# Altium project Obscurum.PrjPcb
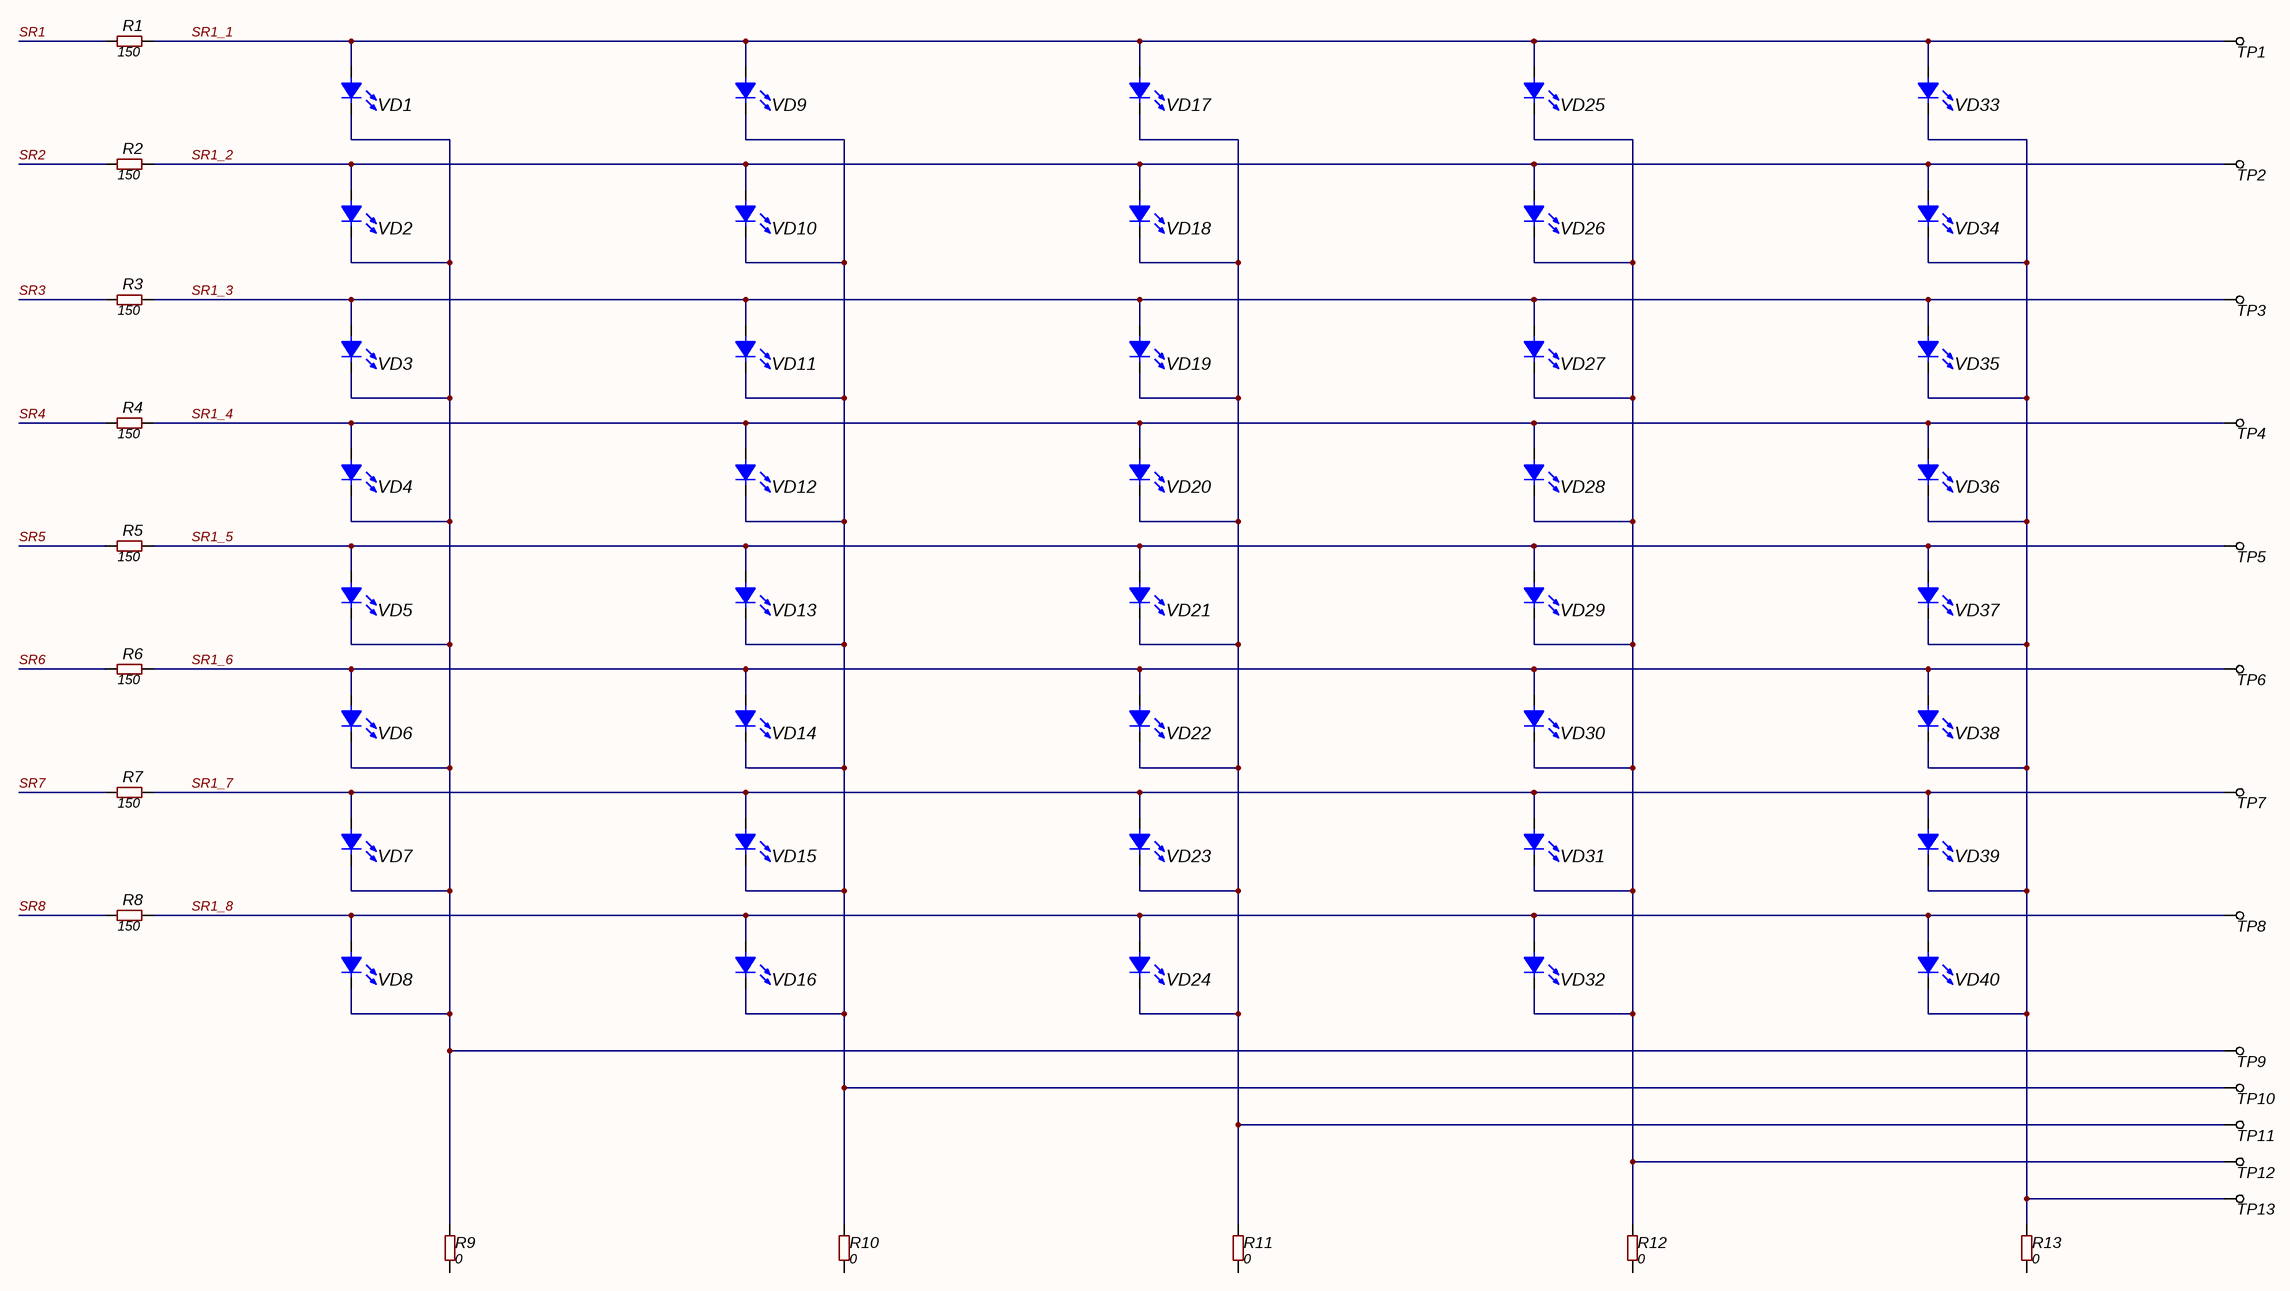
[diagram p0: 1206_array.SchDoc]
3 sheets, 139 parts. Net scope: global (net labels, ports and power ports of the same name join across sheets).
Board file: PCB1.PcbDoc
Sheets:
  1206_array.SchDoc
  0805_array.SchDoc
  Board.SchDoc

## Sheet 1206_array.SchDoc
size 594 x 420 mm; Address1: Address1; Address2: Address2; Address3: Address3; Address4: Address4; DocumentNumber: АБВГ.123456.001 Э3; SheetNumber: 1; SheetTotal: 3; Scale: 1:1; DocumentType: Схема электрическая принципиальная; FirstReferrence: АБВГ.123456.001

### Parts
R1  value 150  [RES: 0603]
R2  value 150  [RES: 0603]
R3  value 150  [RES: 0603]
R4  value 150  [RES: 0603]
R5  value 150  [RES: 0603]
R6  value 150  [RES: 0603]
R7  value 150  [RES: 0603]
R8  value 150  [RES: 0603]
R9  value 0  [RES: 0603]
R10  value 0  [RES: 0603]
R11  value 0  [RES: 0603]
R12  value 0  [RES: 0603]
R13  value 0  [RES: 0603]
TP1  Testpoint_HS1mm  [TestPoint(without 3D)]  (value not drawn)
TP2  Testpoint_HS1mm  [TestPoint(without 3D)]  (value not drawn)
TP3  Testpoint_HS1mm  [TestPoint(without 3D)]  (value not drawn)
TP4  Testpoint_HS1mm  [TestPoint(without 3D)]  (value not drawn)
TP5  Testpoint_HS1mm  [TestPoint(without 3D)]  (value not drawn)
TP6  Testpoint_HS1mm  [TestPoint(without 3D)]  (value not drawn)
TP7  Testpoint_HS1mm  [TestPoint(without 3D)]  (value not drawn)
TP8  Testpoint_HS1mm  [TestPoint(without 3D)]  (value not drawn)
TP9  Testpoint_HS1mm  [TestPoint(without 3D)]  (value not drawn)
TP10  Testpoint_HS1mm  [TestPoint(without 3D)]  (value not drawn)
TP11  Testpoint_HS1mm  [TestPoint(without 3D)]  (value not drawn)
TP12  Testpoint_HS1mm  [TestPoint(without 3D)]  (value not drawn)
TP13  Testpoint_HS1mm  [TestPoint(without 3D)]  (value not drawn)
VD1  (no value)  [LED: 1206Y]
VD2  (no value)  [LED: 1206Y]
VD3  (no value)  [LED: 1206Y]
VD4  (no value)  [LED: 1206Y]
VD5  (no value)  [LED: 1206Y]
VD6  (no value)  [LED: 1206Y]
VD7  (no value)  [LED: 1206Y]
VD8  (no value)  [LED: 1206Y]
VD9  (no value)  [LED: 1206Y]
VD10  (no value)  [LED: 1206Y]
VD11  (no value)  [LED: 1206Y]
VD12  (no value)  [LED: 1206Y]
VD13  (no value)  [LED: 1206Y]
VD14  (no value)  [LED: 1206Y]
VD15  (no value)  [LED: 1206Y]
VD16  (no value)  [LED: 1206Y]
VD17  (no value)  [LED: 1206Y]
VD18  (no value)  [LED: 1206Y]
VD19  (no value)  [LED: 1206Y]
VD20  (no value)  [LED: 1206Y]
VD21  (no value)  [LED: 1206Y]
VD22  (no value)  [LED: 1206Y]
VD23  (no value)  [LED: 1206Y]
VD24  (no value)  [LED: 1206Y]
VD25  (no value)  [LED: 1206Y]
VD26  (no value)  [LED: 1206Y]
VD27  (no value)  [LED: 1206Y]
VD28  (no value)  [LED: 1206Y]
VD29  (no value)  [LED: 1206Y]
VD30  (no value)  [LED: 1206Y]
VD31  (no value)  [LED: 1206Y]
VD32  (no value)  [LED: 1206Y]
VD33  (no value)  [LED: 1206Y]
VD34  (no value)  [LED: 1206Y]
VD35  (no value)  [LED: 1206Y]
VD36  (no value)  [LED: 1206Y]
VD37  (no value)  [LED: 1206Y]
VD38  (no value)  [LED: 1206Y]
VD39  (no value)  [LED: 1206Y]
VD40  (no value)  [LED: 1206Y]

### Nets
SR1: R1.1
SR1_1: R1.2 TP1.1 VD1.1(A) VD9.1(A) VD17.1(A) VD25.1(A) VD33.1(A)
SR1_2: R2.2 TP2.1 VD2.1(A) VD10.1(A) VD18.1(A) VD26.1(A) VD34.1(A)
SR1_3: R3.2 TP3.1 VD3.1(A) VD11.1(A) VD19.1(A) VD27.1(A) VD35.1(A)
SR1_4: R4.2 TP4.1 VD4.1(A) VD12.1(A) VD20.1(A) VD28.1(A) VD36.1(A)
SR1_5: R5.2 TP5.1 VD5.1(A) VD13.1(A) VD21.1(A) VD29.1(A) VD37.1(A)
SR1_6: R6.2 TP6.1 VD6.1(A) VD14.1(A) VD22.1(A) VD30.1(A) VD38.1(A)
SR1_7: R7.2 TP7.1 VD7.1(A) VD15.1(A) VD23.1(A) VD31.1(A) VD39.1(A)
SR1_8: R8.2 TP8.1 VD8.1(A) VD16.1(A) VD24.1(A) VD32.1(A) VD40.1(A)
SR2: R2.1
SR3: R3.1
SR4: R4.1
SR5: R5.1
SR6: R6.1
SR7: R7.1
SR8: R8.1
NetR9_2: R9.2 TP9.1 VD1.2(C) VD2.2(C) VD3.2(C) VD4.2(C) VD5.2(C) VD6.2(C) VD7.2(C) VD8.2(C)
NetR10_2: R10.2 TP10.1 VD9.2(C) VD10.2(C) VD11.2(C) VD12.2(C) VD13.2(C) VD14.2(C) VD15.2(C) VD16.2(C)
NetR11_2: R11.2 TP11.1 VD17.2(C) VD18.2(C) VD19.2(C) VD20.2(C) VD21.2(C) VD22.2(C) VD23.2(C) VD24.2(C)
NetR12_2: R12.2 TP12.1 VD25.2(C) VD26.2(C) VD27.2(C) VD28.2(C) VD29.2(C) VD30.2(C) VD31.2(C) VD32.2(C)
NetR13_2: R13.2 TP13.1 VD33.2(C) VD34.2(C) VD35.2(C) VD36.2(C) VD37.2(C) VD38.2(C) VD39.2(C) VD40.2(C)

Not connected (* = marked no-connect by the designer): R9 1; R10 1; R11 1; R12 1; R13 1

### Notes on the sheet
- Перв. примен.
- Справ. №
- Подп. и дата
- Инв. № дубл.
- Взам. инв. №
- Разраб.
- Изм.
- Лист
- № докум.
- Подп.
- Дата
- Лит.
- Масса
- Масштаб
- Пров.
- Т.контр.
- Листов
- Инв. № подл.
- Утв.
- Н.контр.
- 2.106-A2
- Копировал
- Формат А2

### Library data of the parts
R1-R13 = Resistor_0603: Manufacturer: Yageo; PartNumber: RC0603JR-07100RL; TypeResistor: Resistor film; Power: 0.1W; Package: 0603; HelpURL: https://www.digikey.com/product-detail/en/yageo/RC0603JR-07100RL/311-100GRCT-ND/729644; ValueManufacturerPartNumber: =TypeResistor+', '+Value+', '+Tolerance+', '+Package+', '+Power+', '+Temperature; Temperature: -55...+125°C
VD1-VD40 = LED_single: ValueManufacturerPartNumber: LED, Green, *, *, *, -55...+150°C; TypeDiode: LED; ColorParameter: Green; Manufacturer: *; Package: *; HelpURL: *; Temperature: -55...+150°C; Current: *; VoltageDrop: *; PartNumber: *; Color: GREEN

## Sheet 0805_array.SchDoc
size 594 x 420 mm; Address1: Address1; Address2: Address2; Address3: Address3; Address4: Address4; DocumentNumber: АБВГ.123456.001 Э3; SheetNumber: 2; SheetTotal: 3; Scale: 1:1; DocumentType: Схема электрическая принципиальная; FirstReferrence: АБВГ.123456.001
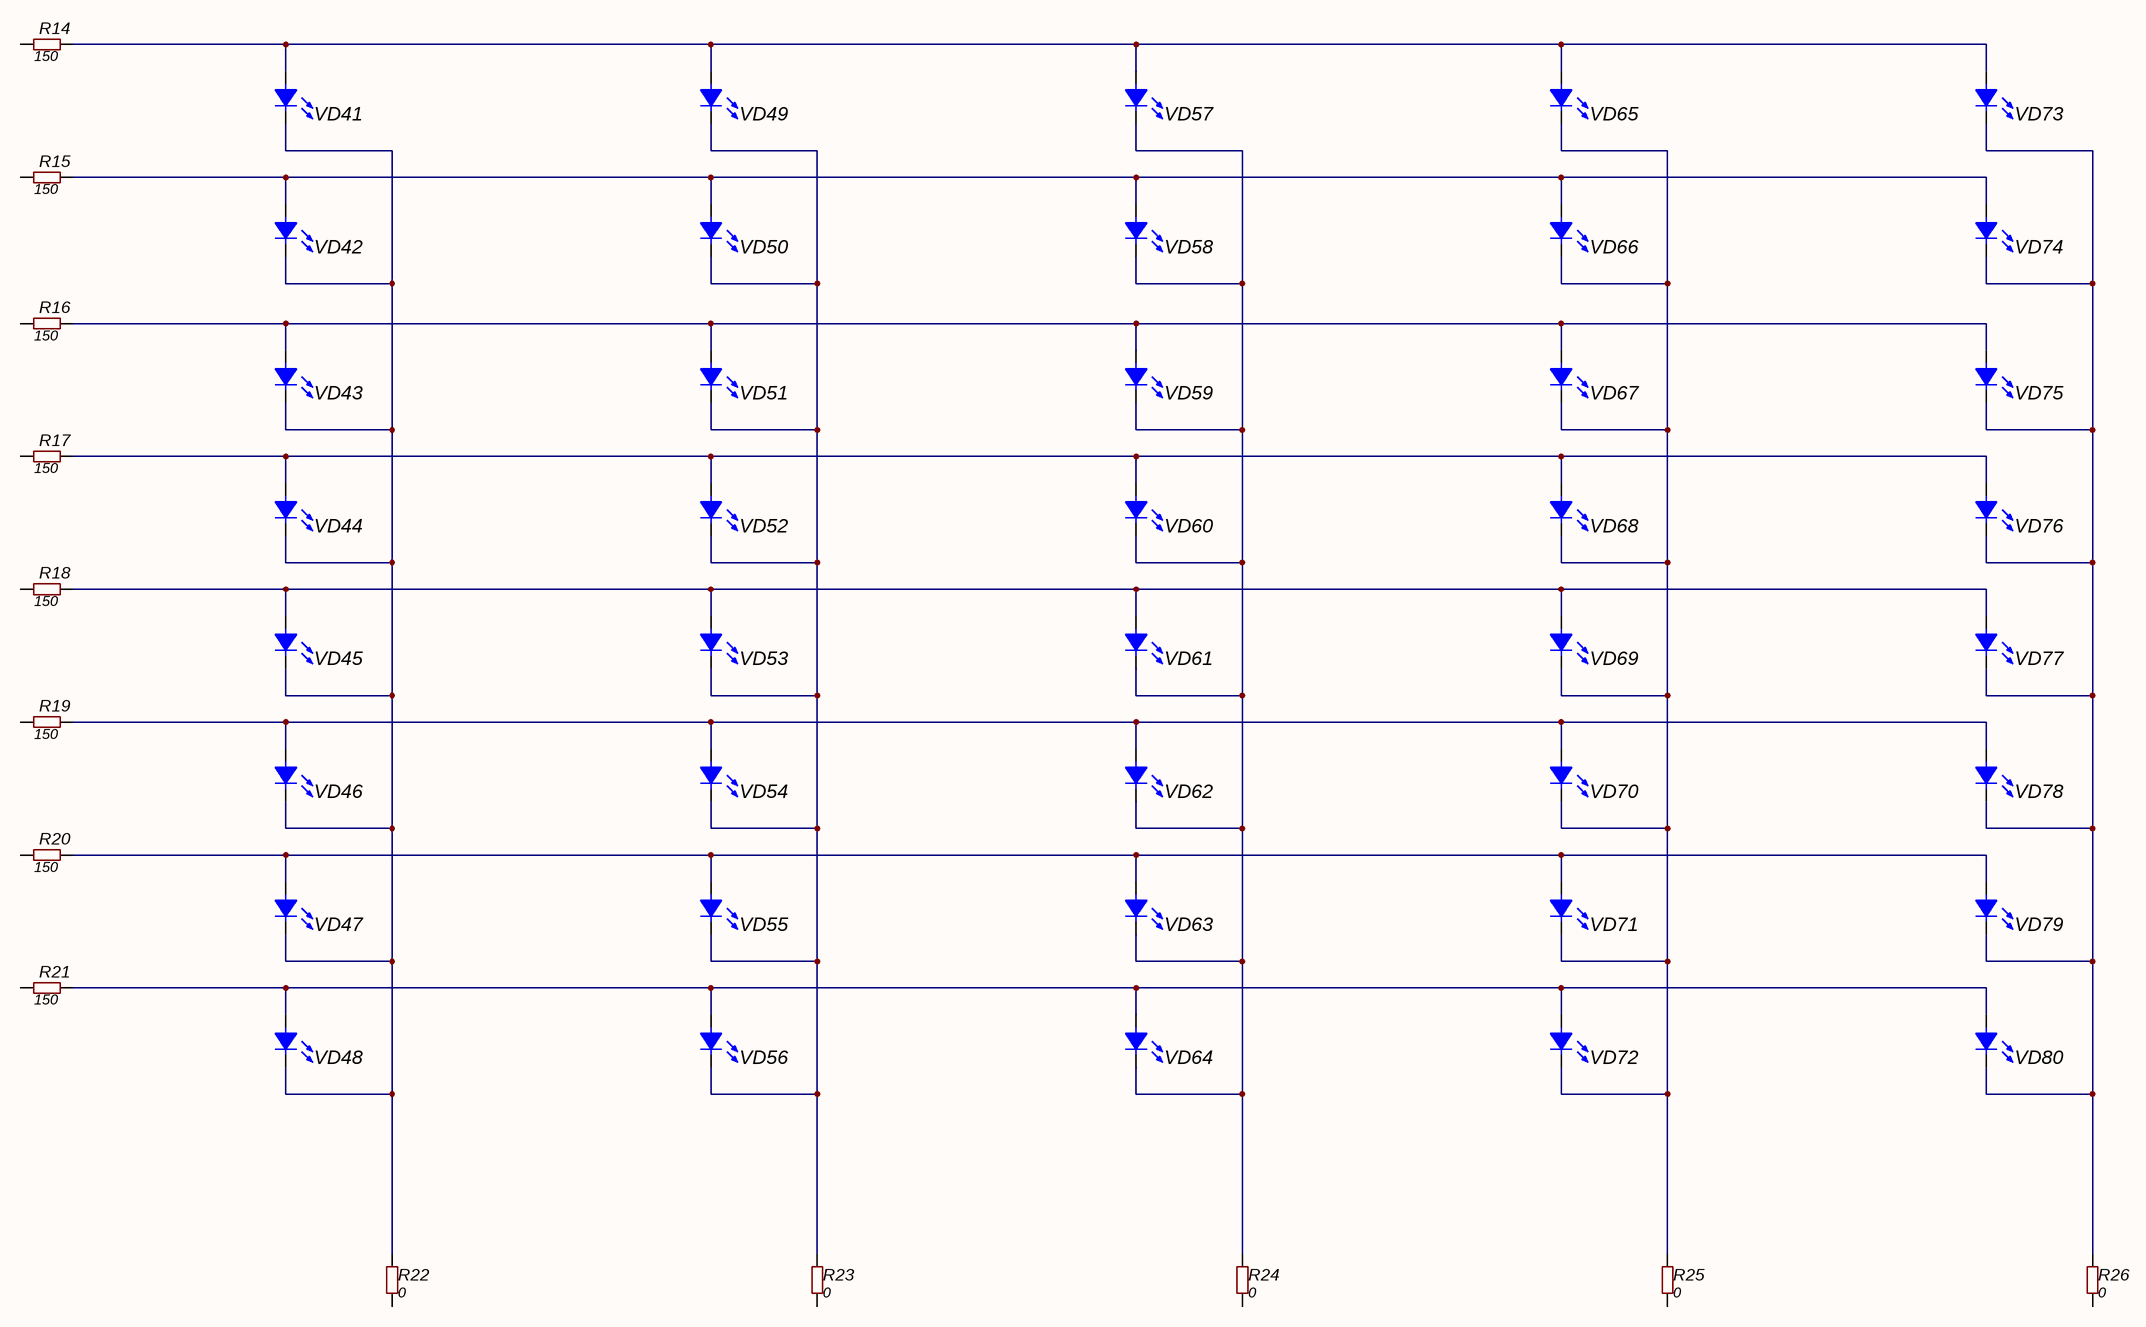
[diagram p1: 0805_array.SchDoc]

### Parts
R14  value 150  [RES: 0603]
R15  value 150  [RES: 0603]
R16  value 150  [RES: 0603]
R17  value 150  [RES: 0603]
R18  value 150  [RES: 0603]
R19  value 150  [RES: 0603]
R20  value 150  [RES: 0603]
R21  value 150  [RES: 0603]
R22  value 0  [RES: 0603]
R23  value 0  [RES: 0603]
R24  value 0  [RES: 0603]
R25  value 0  [RES: 0603]
R26  value 0  [RES: 0603]
VD41  (no value)  [LED: 0805Y]
VD42  (no value)  [LED: 0805Y]
VD43  (no value)  [LED: 0805Y]
VD44  (no value)  [LED: 0805Y]
VD45  (no value)  [LED: 0805Y]
VD46  (no value)  [LED: 0805Y]
VD47  (no value)  [LED: 0805Y]
VD48  (no value)  [LED: 0805Y]
VD49  (no value)  [LED: 0805Y]
VD50  (no value)  [LED: 0805Y]
VD51  (no value)  [LED: 0805Y]
VD52  (no value)  [LED: 0805Y]
VD53  (no value)  [LED: 0805Y]
VD54  (no value)  [LED: 0805Y]
VD55  (no value)  [LED: 0805Y]
VD56  (no value)  [LED: 0805Y]
VD57  (no value)  [LED: 0805Y]
VD58  (no value)  [LED: 0805Y]
VD59  (no value)  [LED: 0805Y]
VD60  (no value)  [LED: 0805Y]
VD61  (no value)  [LED: 0805Y]
VD62  (no value)  [LED: 0805Y]
VD63  (no value)  [LED: 0805Y]
VD64  (no value)  [LED: 0805Y]
VD65  (no value)  [LED: 0805Y]
VD66  (no value)  [LED: 0805Y]
VD67  (no value)  [LED: 0805Y]
VD68  (no value)  [LED: 0805Y]
VD69  (no value)  [LED: 0805Y]
VD70  (no value)  [LED: 0805Y]
VD71  (no value)  [LED: 0805Y]
VD72  (no value)  [LED: 0805Y]
VD73  (no value)  [LED: 0805Y]
VD74  (no value)  [LED: 0805Y]
VD75  (no value)  [LED: 0805Y]
VD76  (no value)  [LED: 0805Y]
VD77  (no value)  [LED: 0805Y]
VD78  (no value)  [LED: 0805Y]
VD79  (no value)  [LED: 0805Y]
VD80  (no value)  [LED: 0805Y]

### Nets
NetR14_2: R14.2 VD41.1(A) VD49.1(A) VD57.1(A) VD65.1(A) VD73.1(A)
NetR15_2: R15.2 VD42.1(A) VD50.1(A) VD58.1(A) VD66.1(A) VD74.1(A)
NetR16_2: R16.2 VD43.1(A) VD51.1(A) VD59.1(A) VD67.1(A) VD75.1(A)
NetR17_2: R17.2 VD44.1(A) VD52.1(A) VD60.1(A) VD68.1(A) VD76.1(A)
NetR18_2: R18.2 VD45.1(A) VD53.1(A) VD61.1(A) VD69.1(A) VD77.1(A)
NetR19_2: R19.2 VD46.1(A) VD54.1(A) VD62.1(A) VD70.1(A) VD78.1(A)
NetR20_2: R20.2 VD47.1(A) VD55.1(A) VD63.1(A) VD71.1(A) VD79.1(A)
NetR21_2: R21.2 VD48.1(A) VD56.1(A) VD64.1(A) VD72.1(A) VD80.1(A)
NetR22_2: R22.2 VD41.2(C) VD42.2(C) VD43.2(C) VD44.2(C) VD45.2(C) VD46.2(C) VD47.2(C) VD48.2(C)
NetR23_2: R23.2 VD49.2(C) VD50.2(C) VD51.2(C) VD52.2(C) VD53.2(C) VD54.2(C) VD55.2(C) VD56.2(C)
NetR24_2: R24.2 VD57.2(C) VD58.2(C) VD59.2(C) VD60.2(C) VD61.2(C) VD62.2(C) VD63.2(C) VD64.2(C)
NetR25_2: R25.2 VD65.2(C) VD66.2(C) VD67.2(C) VD68.2(C) VD69.2(C) VD70.2(C) VD71.2(C) VD72.2(C)
NetR26_2: R26.2 VD73.2(C) VD74.2(C) VD75.2(C) VD76.2(C) VD77.2(C) VD78.2(C) VD79.2(C) VD80.2(C)

Not connected (* = marked no-connect by the designer): R14 1; R15 1; R16 1; R17 1; R18 1; R19 1; R20 1; R21 1; R22 1; R23 1; R24 1; R25 1; R26 1

### Notes on the sheet
- Перв. примен.
- Справ. №
- Подп. и дата
- Инв. № дубл.
- Взам. инв. №
- Инв. № подл.
- Изм.
- Лист
- № докум.
- Подп.
- Дата
- 2.106-A2
- Копировал
- Формат А2

### Library data of the parts
R14-R26 = Resistor_0603: as R1 on sheet 1206_array; Package: 0603; HelpURL: https://www.digikey.com/product-detail/en/yageo/RC0603JR-07100RL/311-100GRCT-ND/729644; ValueManufacturerPartNumber: =TypeResistor+', '+Value+', '+Tolerance+', '+Package+', '+Power+', '+Temperature; Temperature: -55...+125°C
VD41-VD80 = LED_single: as VD1 on sheet 1206_array; Manufacturer: *; Package: *; HelpURL: *; Temperature: -55...+150°C; Current: *; VoltageDrop: *; PartNumber: *; Color: GREEN

## Sheet Board.SchDoc
size 420 x 297 mm; Address1: Address1; Address2: Address2; Address3: Address3; Address4: Address4; DocumentNumber: АБВГ.123456.001 Э3; SheetNumber: 3; SheetTotal: 3; Scale: 1:1; DocumentType: Схема электрическая принципиальная; FirstReferrence: АБВГ.123456.001
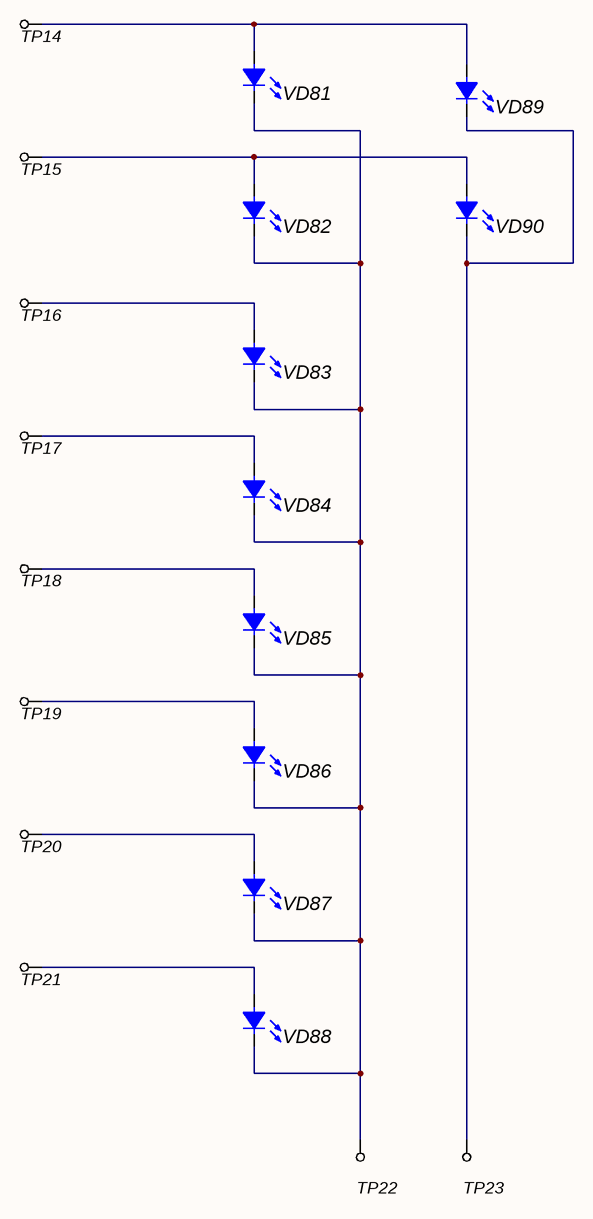
[diagram p2: Board.SchDoc]

### Parts
TP14  Testpoint_HS1mm  [TestPoint(without 3D)]  (value not drawn)
TP15  Testpoint_HS1mm  [TestPoint(without 3D)]  (value not drawn)
TP16  Testpoint_HS1mm  [TestPoint(without 3D)]  (value not drawn)
TP17  Testpoint_HS1mm  [TestPoint(without 3D)]  (value not drawn)
TP18  Testpoint_HS1mm  [TestPoint(without 3D)]  (value not drawn)
TP19  Testpoint_HS1mm  [TestPoint(without 3D)]  (value not drawn)
TP20  Testpoint_HS1mm  [TestPoint(without 3D)]  (value not drawn)
TP21  Testpoint_HS1mm  [TestPoint(without 3D)]  (value not drawn)
TP22  Testpoint_HS1mm  [TestPoint(without 3D)]  (value not drawn)
TP23  Testpoint_HS1mm  [TestPoint(without 3D)]  (value not drawn)
VD81  (no value)  [LED: 1206Y]
VD82  (no value)  [LED: 1206Y]
VD83  (no value)  [LED: 1206Y]
VD84  (no value)  [LED: 1206Y]
VD85  (no value)  [LED: 1206Y]
VD86  (no value)  [LED: 1206Y]
VD87  (no value)  [LED: 1206Y]
VD88  (no value)  [LED: 1206Y]
VD89  (no value)  [LED: 1206Y]
VD90  (no value)  [LED: 1206Y]

### Nets
NetTP14_1: TP14.1 VD81.1(A) VD89.1(A)
NetTP15_1: TP15.1 VD82.1(A) VD90.1(A)
NetTP16_1: TP16.1 VD83.1(A)
NetTP17_1: TP17.1 VD84.1(A)
NetTP18_1: TP18.1 VD85.1(A)
NetTP19_1: TP19.1 VD86.1(A)
NetTP20_1: TP20.1 VD87.1(A)
NetTP21_1: TP21.1 VD88.1(A)
NetTP22_1: TP22.1 VD81.2(C) VD82.2(C) VD83.2(C) VD84.2(C) VD85.2(C) VD86.2(C) VD87.2(C) VD88.2(C)
NetTP23_1: TP23.1 VD89.2(C) VD90.2(C)

### Notes on the sheet
- Перв. примен.
- Справ. №
- Подп. и дата
- Инв. № дубл.
- Взам. инв. №
- Разраб.
- Изм.
- Лист
- № докум.
- Подп.
- Дата
- Лит.
- Масса
- Масштаб
- Пров.
- Т.контр.
- Листов
- Инв. № подл.
- Утв.
- Н.контр.
- 2.106-A3
- Копировал
- Формат А3

### Library data of the parts
VD81-VD90 = LED_single: as VD1 on sheet 1206_array; Manufacturer: *; Package: *; HelpURL: *; Temperature: -55...+150°C; Current: *; VoltageDrop: *; PartNumber: *; Color: GREEN